# EAGLE design monulator-usb-avr8 (EAGLE 5.11)
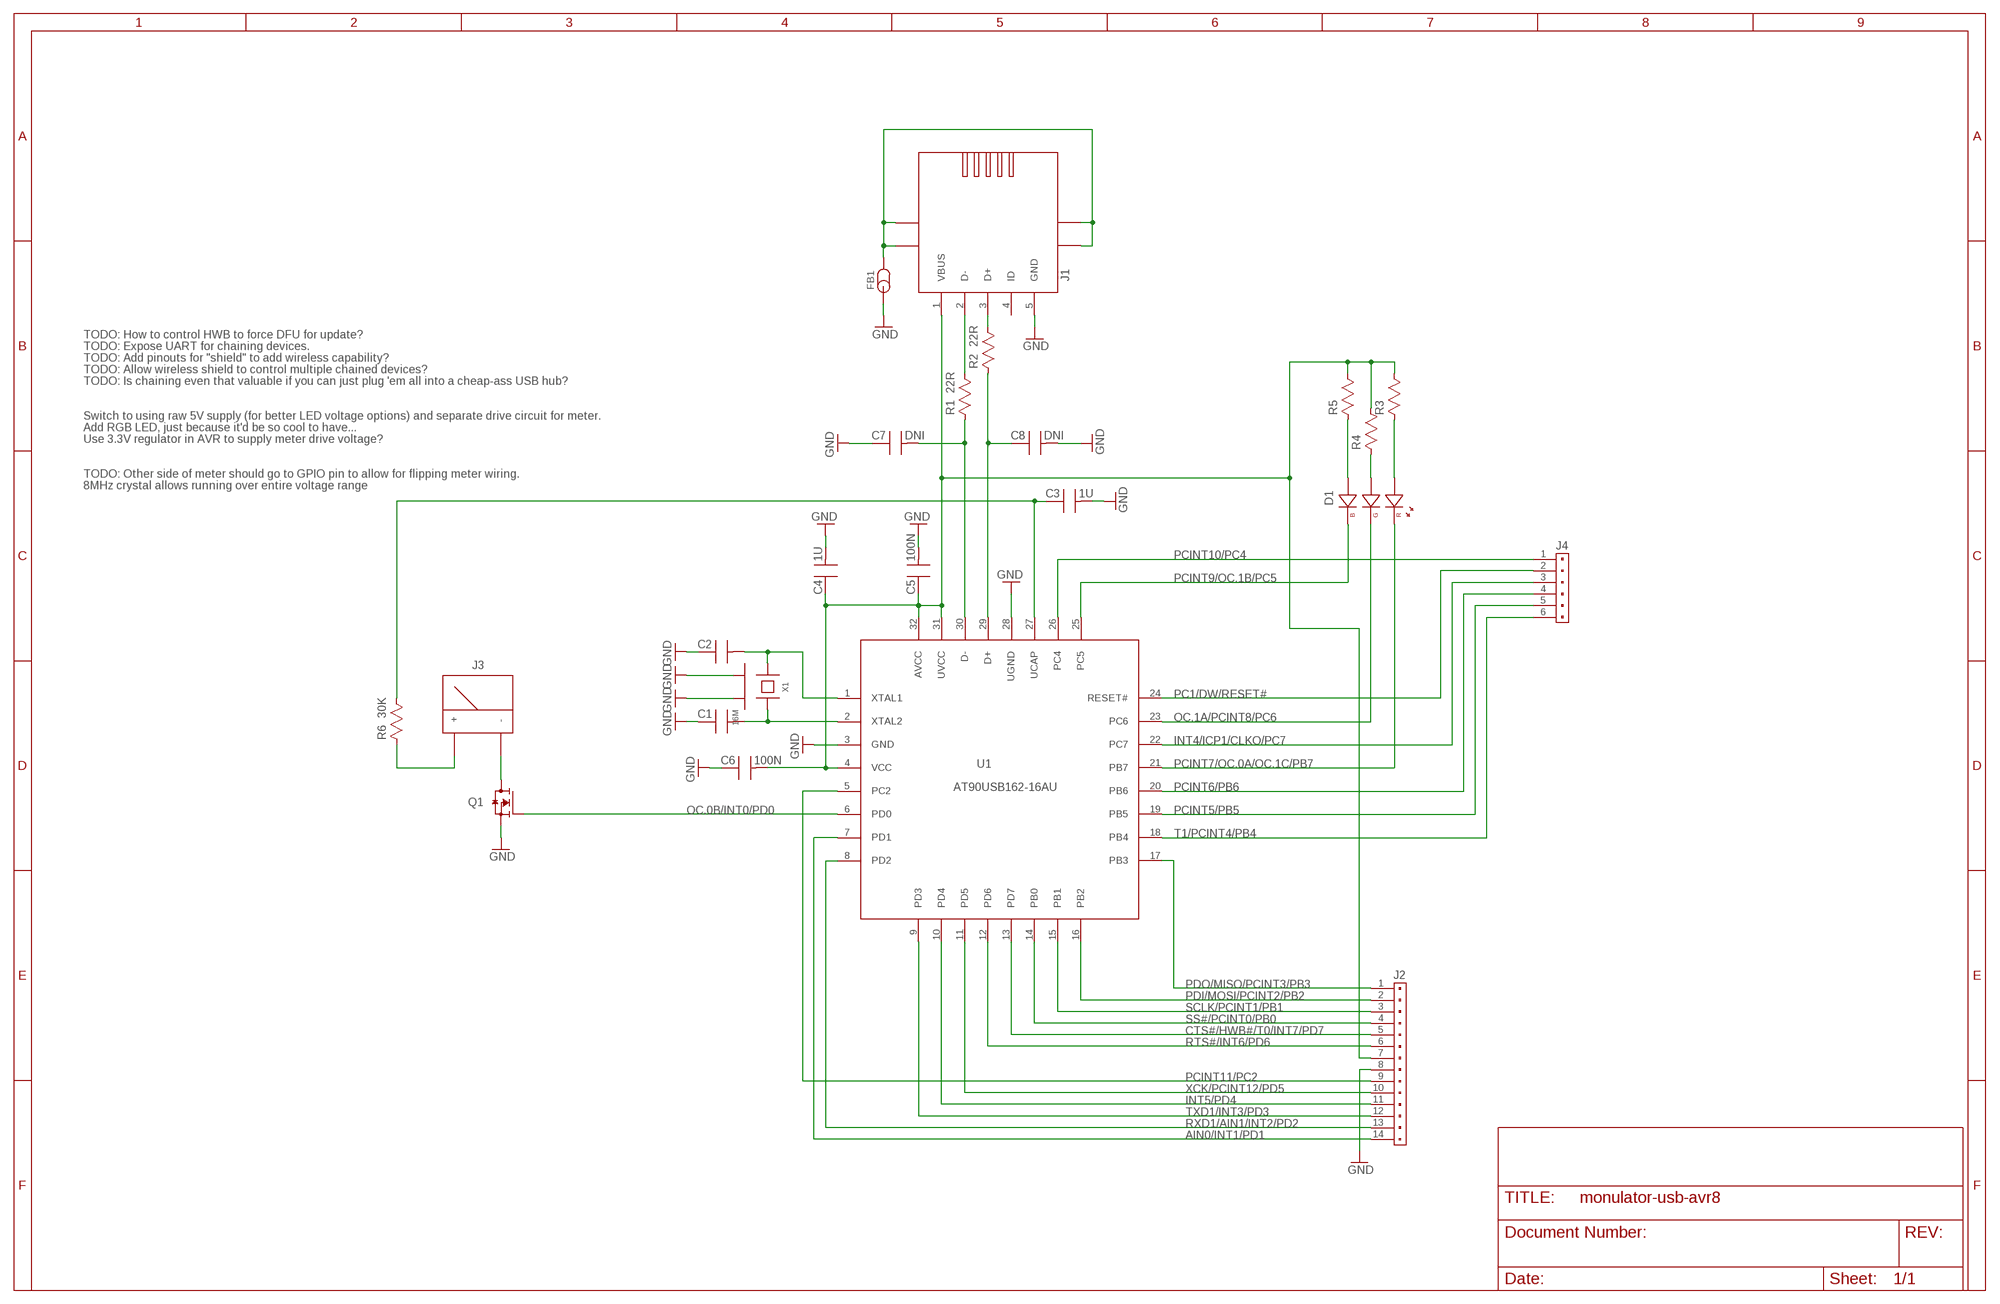
[diagram p0: schematic, sheet 1]

## Parts
C1  C0603_90  [CAPC1608X90N]
C2  C0603_90  [CAPC1608X90N]
C3  1U  C0603_90  [CAPC1608X90N]
C4  1U  C0603_90  [CAPC1608X90N]
C5  100N  C0603_90  [CAPC1608X90N]
C6  100N  C0603_90  [CAPC1608X90N]
C7  DNI  C0603_90  [CAPC1608X90N]
C8  DNI  C0603_90  [CAPC1608X90N]
D1  LED_RGB_5060_6  [RGB_LED5060_6]
FB1  FB0603  [INDC1608X95N]
J1  USB_MINI_B_HIROSE_UX60_MB_5ST  [HIROSE_UX60_MB_5ST]
J2  HEADER1X14TH-200  [HEADER200P1X14]
J3  METERGME_PM89  [GME_PM89]
J4  HEADER1X6TH-200  [HEADER200P1X6]
Q1  DMN2075U-7  [SOT95P237X117-3N]
R1  22R  R0603_55  [RESC1608X55N]
R2  22R  R0603_55  [RESC1608X55N]
R3  R0603_55  [RESC1608X55N]
R4  R0603_55  [RESC1608X55N]
R5  R0603_55  [RESC1608X55N]
R6  30K  R0603_55  [RESC1608X55N]
U1  AT90USB162-16AU  [QFP80P900X900X120-32N]
X1  16M  X_CASE2_NDK_NX3225SA  [OSCCC250X320X70-4N]

## Nets
AIN0/INT1/PD1: J2.14 U1.7(PD1)
CTS#/HWB#/T0/INT7/PD7: J2.5 U1.13(PD7)
GND: C1.1 C2.1 C3.2 C4.2 C5.2 C6.1 C7.1 C8.2 FB1.1 J1.5(GND) J2.8 Q1.2(S) U1.3(GND) U1.28(UGND) X1.2(CASE) X1.4(CASE)
INT4/ICP1/CLKO/PC7: J4.3 U1.22(PC7)
INT5/PD4: J2.11 U1.10(PD4)
N$1: C2.2 U1.1(XTAL1) X1.1
N$2: C7.2 R1.1 U1.30(D-)
N$3: C8.1 R2.1 U1.29(D+)
N$4: J1.2(D-) R1.2
N$5: J1.3(D+) R2.2
N$6: J3.- Q1.3(D)
N$7: J3.+ R6.1
N$8: C1.2 U1.2(XTAL2) X1.3
N$9: D1.3(A_B) R5.1
N$10: D1.2(A_G) R4.1
N$11: D1.1(A_R) R3.1
OC.0B/INT0/PD0: Q1.1(G) U1.6(PD0)
OC.1A/PCINT8/PC6: D1.5(C_G) U1.23(PC6)
PC1/DW/RESET#: J4.2 U1.24(RESET#)
PCINT5/PB5: J4.5 U1.19(PB5)
PCINT6/PB6: J4.4 U1.20(PB6)
PCINT7/OC.0A/OC.1C/PB7: D1.6(C_R) U1.21(PB7)
PCINT9/OC.1B/PC5: D1.4(C_B) U1.25(PC5)
PCINT10/PC4: J4.1 U1.26(PC4)
PCINT11/PC2: J2.9 U1.5(PC2)
PDI/MOSI/PCINT2/PB2: J2.2 U1.16(PB2)
PDO/MISO/PCINT3/PB3: J2.1 U1.17(PB3)
RTS#/INT6/PD6: J2.6 U1.12(PD6)
RXD1/AIN1/INT2/PD2: J2.13 U1.8(PD2)
SCLK/PCINT1/PB1: J2.3 U1.15(PB1)
SS#/PCINT0/PB0: J2.4 U1.14(PB0)
T1/PCINT4/PB4: J4.6 U1.18(PB4)
TXD1/INT3/PD3: J2.12 U1.9(PD3)
USB_SHIELD: FB1.2 J1.SHIELD@1(SHIELD) J1.SHIELD@2(SHIELD) J1.SHIELD@3(SHIELD) J1.SHIELD@4(SHIELD)
VBUS: C4.1 C5.1 C6.2 J1.1(VBUS) J2.7 R3.2 R4.2 R5.2 U1.4(VCC) U1.31(UVCC) U1.32(AVCC)
VREG: C3.1 R6.2 U1.27(UCAP)
XCK/PCINT12/PD5: J2.10 U1.11(PD5)
Unconnected: J1.4(ID)

## Notes on the sheet
- TODO: How to control HWB to force DFU for update?
- TODO: Expose UART for chaining devices.
- TODO: Add pinouts for "shield" to add wireless capability?
- TODO: Allow wireless shield to control multiple chained devices?
- TODO: Is chaining even that valuable if you can just plug 'em all into a cheap-ass USB hub?
- Switch to using raw 5V supply (for better LED voltage options) and separate drive circuit for meter.
- Add RGB LED, just because it'd be so cool to have...
- Use 3.3V regulator in AVR to supply meter drive voltage?
- TODO: Other side of meter should go to GPIO pin to allow for flipping meter wiring.
- 8MHz crystal allows running over entire voltage range

## Library data of the parts
C1-C8 = capacitor:C
D1 = led:LED_RGB
FB1 = inductor:FB
J1 = usb:USB_MINI_B
J2 = stake:HEADER1X14
J3 = meters:METER
J4 = stake:HEADER1X6
Q1 = mosfet:DMN2075U
R1-R6 = resistor:R
U1 = atmel:AT90USB*?AU
X1 = crystal:X_CASE2

## Board
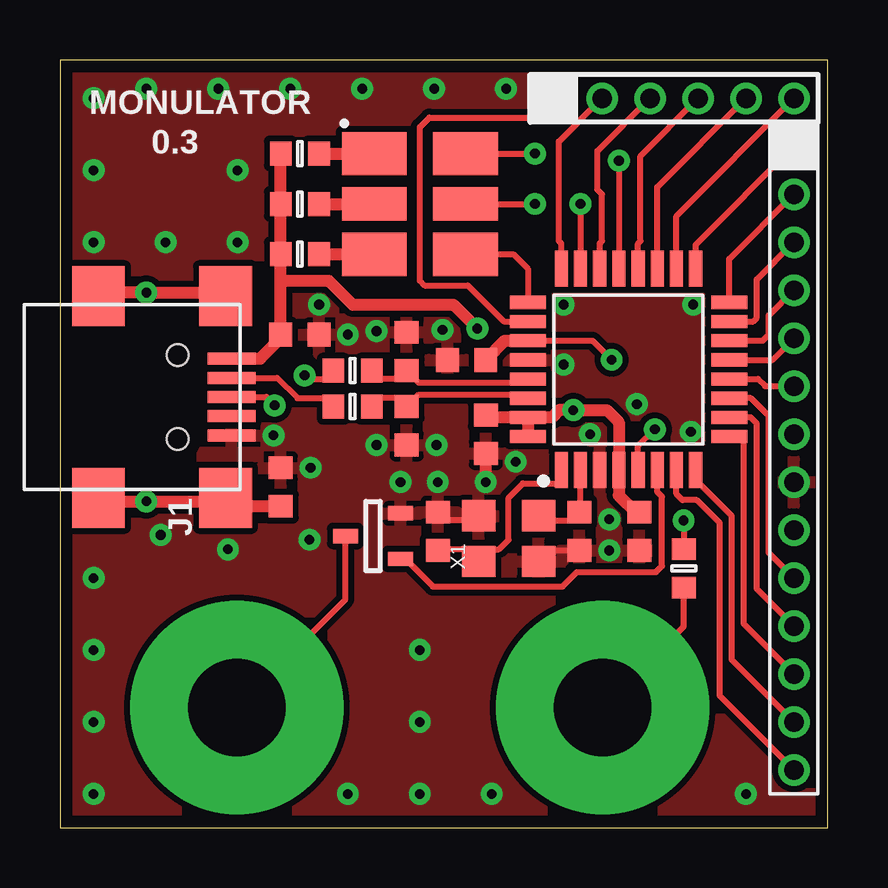
[diagram p1: board, top side]
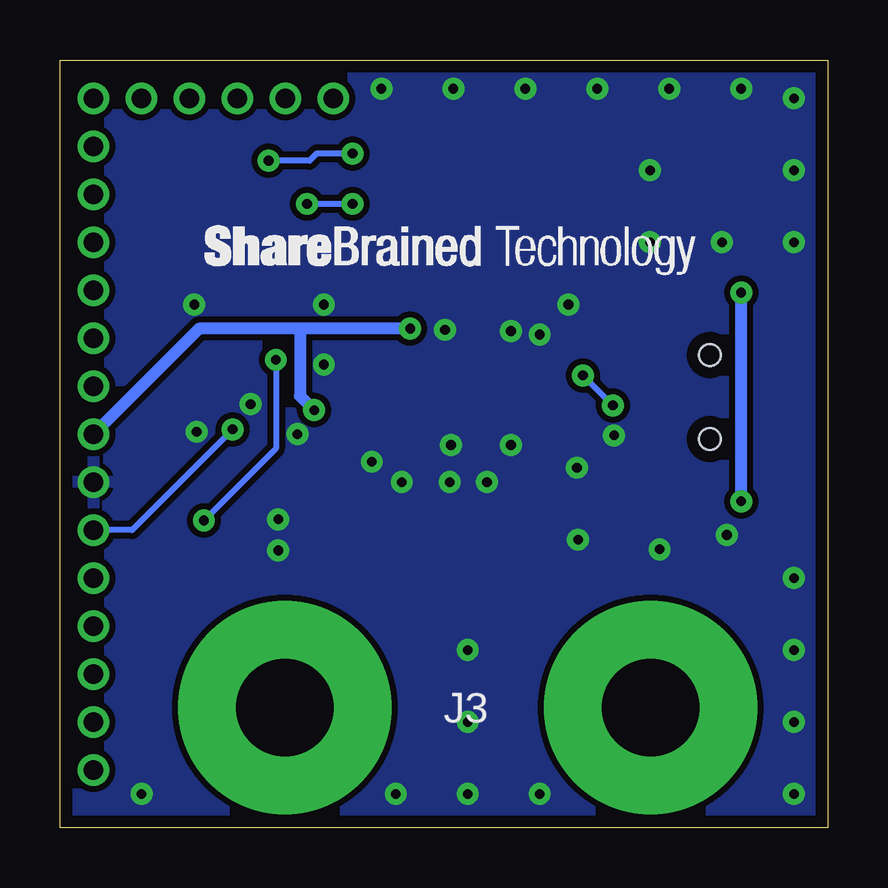
[diagram p2: board, bottom side, seen from below]

Size 32 x 32 mm. Coordinates in mm from the lower left corner, seen from the top.
Outline: 0,0 32,0 32,32 0,32 0,0
Copper layers (1+16): Top 0.0356mm / dielectric 1.5mm / Bottom 0.0356mm
Design rules "laen-two-max *": minimum track width 0.25mm, minimum drill 16mil, track to track 0.25mm, track to pad 0.25mm, pad to pad 0.25mm, via to via 0.25mm, smd to smd 0.25mm, copper to edge 20mil, drill to drill 16mil, minimum pad ring 10mil, minimum via ring 10mil, stop-mask expansion 3mil, vias tented up to drill 16mil, thermal gap 8mil

### Footprints (pad centres in the part's own frame; a part is rotated, then mirrored left to right if it is on the bottom)
CAPC1608X90N = smd 0.95 x 1: 1 -0.8,0; 2 0.8,0
RGB_LED5060_6 = smd 2.7 x 1.8: 1 -1.9,2.1; 3 -1.9,-2.1; 4 1.9,-2.1; 6 1.9,2.1 | smd 2.7 x 1.4: 2 -1.9,0; 5 1.9,0
INDC1608X95N = smd 0.95 x 1: 1 -0.8,0; 2 0.8,0
HIROSE_UX60_MB_5ST = smd 0.5 x 2: 1 -1.6,4.15; 2 -0.8,4.15; 3 0,4.15; 4 0.8,4.15; 5 1.6,4.15 | smd 2.5 x 2.2: SHIELD@1 -4.2,-1.4; SHIELD@2 -4.2,3.9; SHIELD@3 4.2,-1.4; SHIELD@4 4.2,3.9 | hole 0.9: -1.75,1.9; 1.75,1.9
HEADER200P1X14 = drill 0.8 round: 1 0,13; 2 0,11; 3 0,9; 4 0,7; 5 0,5; 6 0,3; 7 0,1; 8 0,-1; 9 0,-3; 10 0,-5; 11 0,-7; 12 0,-9; 13 0,-11; 14 0,-13
GME_PM89 = drill 4.064 pad 8.89 round: + -7.62,0; - 7.62,0
HEADER200P1X6 = drill 0.8 round: 1 0,5; 2 0,3; 3 0,1; 4 0,-1; 5 0,-3; 6 0,-5
SOT95P237X117-3N = smd 1.05 x 0.6: 1 -1.15,0.95; 2 -1.15,-0.95; 3 1.15,0
RESC1608X55N = smd 0.9 x 1: 1 -0.8,0; 2 0.8,0
QFP80P900X900X120-32N = smd 1.5 x 0.55: 1 -4.2,2.8; 2 -4.2,2; 3 -4.2,1.2; 4 -4.2,0.4; 5 -4.2,-0.4; 6 -4.2,-1.2; 7 -4.2,-2; 8 -4.2,-2.8; 17 4.2,-2.8; 18 4.2,-2; 19 4.2,-1.2; 20 4.2,-0.4; 21 4.2,0.4; 22 4.2,1.2; 23 4.2,2; 24 4.2,2.8 | smd 0.55 x 1.5: 9 -2.8,-4.2; 10 -2,-4.2; 11 -1.2,-4.2; 12 -0.4,-4.2; 13 0.4,-4.2; 14 1.2,-4.2; 15 2,-4.2; 16 2.8,-4.2; 25 2.8,4.2; 26 2,4.2; 27 1.2,4.2; 28 0.4,4.2; 29 -0.4,4.2; 30 -1.2,4.2; 31 -2,4.2; 32 -2.8,4.2
OSCCC250X320X70-4N = smd 1.3 x 1.4: 1 -0.95,1.25; 2 -0.95,-1.25; 3 0.95,-1.25; 4 0.95,1.25

### Placement (x,y rotation side)
C1  21.65,12.35 90 top
C2  15.75,12.35 270 top
C3  16.95,19.5 180 top
C4  10,20.55 0 top
C5  17.75,16.4 270 top
C6  24.15,12.35 90 top
C7  14.45,16.75 90 top
C8  14.45,19.85 90 top
D1  15,26 0 top
FB1  9.2,14.2 270 top
J1  3,17.95 270 top
J2  30.6,15.4 0 top
J3  15,5 0 bottom
J4  25.6,30.4 90 top
Q1  13.05,12.15 180 top
R1  12.2,17.55 180 top
R2  12.2,19.05 180 top
R3  10,28.1 180 top
R4  10,26 180 top
R5  10,23.9 180 top
R6  26,10.8 90 top
U1  23.7,19.1 90 top
U$1  [NAME_750_1000]  26.05,22.95 0 bottom
X1  18.7,12.05 90 top

### Tracks (layer width: path | path; a pad name or v marks a point on that pad's centre or on a via)
AIN0/INT1/PD1
  Top 0.25: U1.7 25.7,13.9 25.95,13.65 26.55,13.65 27.5,12.7 27.5,5.5 J2.14
CTS#/HWB#/T0/INT7/PD7
  Top 0.25: U1.13 29.7,19.5 J2.5
GND  (via drill 0.41)
  Top 0.25: X1.4 17.45,12.8 15.75,12.8 C2.1 | C1.1 20.4,11.55 X1.2
  Top 0.5: 17.75,14.6 C5.2
  other vias: 22.1,16.4 21,19.3 19,15.25 1.4,7.4 1.4,1.4 1.4,4.4 28.6,1.4 12,1.4 18,1.4 15,1.4 15,4.4 15,7.4 8.9,16.35 15.95,20.75 17.75,14.4 12,20.55 10.8,21.8 21,21.8 26.3,16.5 24.05,17.65 26.4,21.8 15.75,14.4 14.2,14.4 22.9,11.55 22.9,12.85 15.7,15.95 13.2,15.95 13.2,20.7 18.6,30.8 1.4,10.4 4.2,12.2 7,11.6 10.4,12 10.45,15 15.6,30.8 12.6,30.8 9.6,30.8 6.6,30.8 3.6,30.8 1.4,24.4 1.4,27.4 1.4,30.4 4.4,24.4 7.4,24.4 7.4,27.4
  pour Bottom (isolate 0.25, rank 2): 0,0 0,32 32,32 32,0
  pour Top (isolate 0.25): 0,0 0,32 32,32 32,0
INT4/ICP1/CLKO/PC7
  Top 0.25: U1.22 22.5,24.35 22.6,24.45 22.6,26.4 22.4,26.6 22.4,28.2 J4.3
INT5/PD4
  Top 0.25: U1.10 28.8,17.1 29.05,16.85 29.05,9.95 J2.11
N$1
  Top 0.25: U1.1 20.9,14.35 19.3,14.35 18.7,13.75 18.7,12 18.3,11.6 17.45,11.6 | X1.1 17.45,11.6 | C2.2 15.75,11.6 17.45,11.6
N$2
  Top 0.25: U1.30 19.35,18.05 14.95,18.05 C7.2 14.1,17.9 13.3,17.9 13,17.6 R1.1
N$3
  Top 0.25: U1.29 19.35,18.55 14.95,18.55 C8.1 14.1,18.7 13.3,18.7 13,19 R2.1
N$4
  Top 0.25: J1.2 9.05,18.75 9.9,17.9 11.05,17.9 R1.2
N$5  (via drill 0.41)
  Top 0.25: J1.3 8.6,17.95 v8.95,17.6 | v10.2,18.85 10.35,18.7 11.05,18.7 R2.2
  Bottom 0.25: v8.95,17.6 v10.2,18.85
N$6
  Top 0.25: Q1.3 11.9,9.52 J3.-
N$7
  Top 0.25: R6.1 26,8.38 J3.+
N$8
  Top 0.25: U1.2 21.7,13.15 C1.2 21.65,12.8 19.95,12.8 X1.3
N$9
  Top 0.5: R5.1 D1.3
N$10
  Top 0.5: R4.1 D1.2
N$11
  Top 0.5: R3.1 D1.1
OC.0B/INT0/PD0
  Top 0.25: U1.6 24.9,14 25.1,13.8 25.1,10.9 24.85,10.65 21.55,10.65 20.95,10.05 15.55,10.05 14.4,11.2 Q1.1
OC.1A/PCINT8/PC6  (via drill 0.41)
  Top 0.25: v21.7,26 U1.23 | D1.5 v19.8,26
  Bottom 0.25: v19.8,26 v21.7,26
PC1/DW/RESET#
  Top 0.25: U1.24 20.9,24.35 20.8,24.45 20.8,28.6 J4.2
PCINT5/PB5
  Top 0.25: U1.19 24.9,26.7 J4.5
PCINT6/PB6
  Top 0.25: U1.20 24.1,24.35 24.2,24.45 24.2,28 J4.4
PCINT7/OC.0A/OC.1C/PB7  (via drill 0.41)
  Top 0.25: v23.3,27.8 U1.21 | D1.6 v19.8,28.1
  Bottom 0.25: v19.8,28.1 21.3,28.1 21.6,27.8 v23.3,27.8
PCINT9/OC.1B/PC5
  Top 0.25: D1.4 18.9,23.9 19.5,23.3 U1.25
PCINT10/PC4
  Top 0.25: U1.26 18.5,21.1 17,22.6 15.2,22.6 15,22.8 15,29.2 15.4,29.6 19.8,29.6 J4.1
PCINT11/PC2  (via drill 0.41)
  Top 0.25: U1.5 24.1,15.9 v24.8,16.6
  Bottom 0.25: J2.9 29,12.4 v24.8,16.6
PDI/MOSI/PCINT2/PB2
  Top 0.25: U1.16 27.9,23.7 J2.2
PDO/MISO/PCINT3/PB3
  Top 0.25: U1.17 26.5,24.3 J2.1
RTS#/INT6/PD6
  Top 0.25: J2.6 29.4,18.4 29.1,18.7 U1.12
RXD1/AIN1/INT2/PD2
  Top 0.25: U1.8 26.5,14.5 28,13 28,7 J2.13
SCLK/PCINT1/PB1
  Top 0.25: U1.15 28.9,21.1 29.05,21.25 29.05,22.85 J2.3
SS#/PCINT0/PB0
  Top 0.25: U1.14 29.3,20.3 29.55,20.55 29.55,21.35 J2.4
T1/PCINT4/PB4
  Top 0.25: U1.18 25.7,25.5 J4.6
TXD1/INT3/PD3
  Top 0.25: U1.9 28.5,16.3 28.5,8.5 J2.12
USB_SHIELD  (via drill 0.41)
  Top 0.5: J1.SHIELD@1 1.6,22.3 v3.6,22.3 6.9,22.3 J1.SHIELD@2 | J1.SHIELD@3 1.6,13.6 v3.6,13.6 6.9,13.6 J1.SHIELD@4 7.25,13.4 FB1.2
  Bottom 0.5: v3.6,13.6 v3.6,22.3
VBUS  (via drill 0.41)
  Top 0.5: C6.2 24,13.15 23.3,13.85 U1.4 23.3,16.9 22.8,17.4 v21.4,17.4 20.8,17.4 20.5,17.1 U1.31 | U1.31 U1.32 | J1.1 8.35,19.55 9.2,20.4 C4.1 9.2,22.8 | 9.2,22.8 R5.2 R4.2 R3.2 | v17.4,20.8 16.4,21.8 12.2,21.8 11.2,22.8 9.2,22.8 | U1.31 17.85,17.1 C5.1
  Bottom 0.5: v21.4,17.4 22,18 22,20.8 | v17.4,20.8 22,20.8 | J2.7 26.2,20.8 22,20.8
VREG  (via drill 0.41)
  Top 0.25: U1.27 22.2,20.3 v23,19.5 | v26,12.8 R6.2
  Top 0.5: U1.27 18.55,20.3 C3.1
  Bottom 0.25: v23,19.5 23,15.8 v26,12.8
XCK/PCINT12/PD5
  Top 0.25: U1.11 28.8,17.9 29.55,17.15 29.55,11.45 J2.10

### Text on the board
tPlace: MONULATOR | 0.3